# Altium project flap.PrjPCB
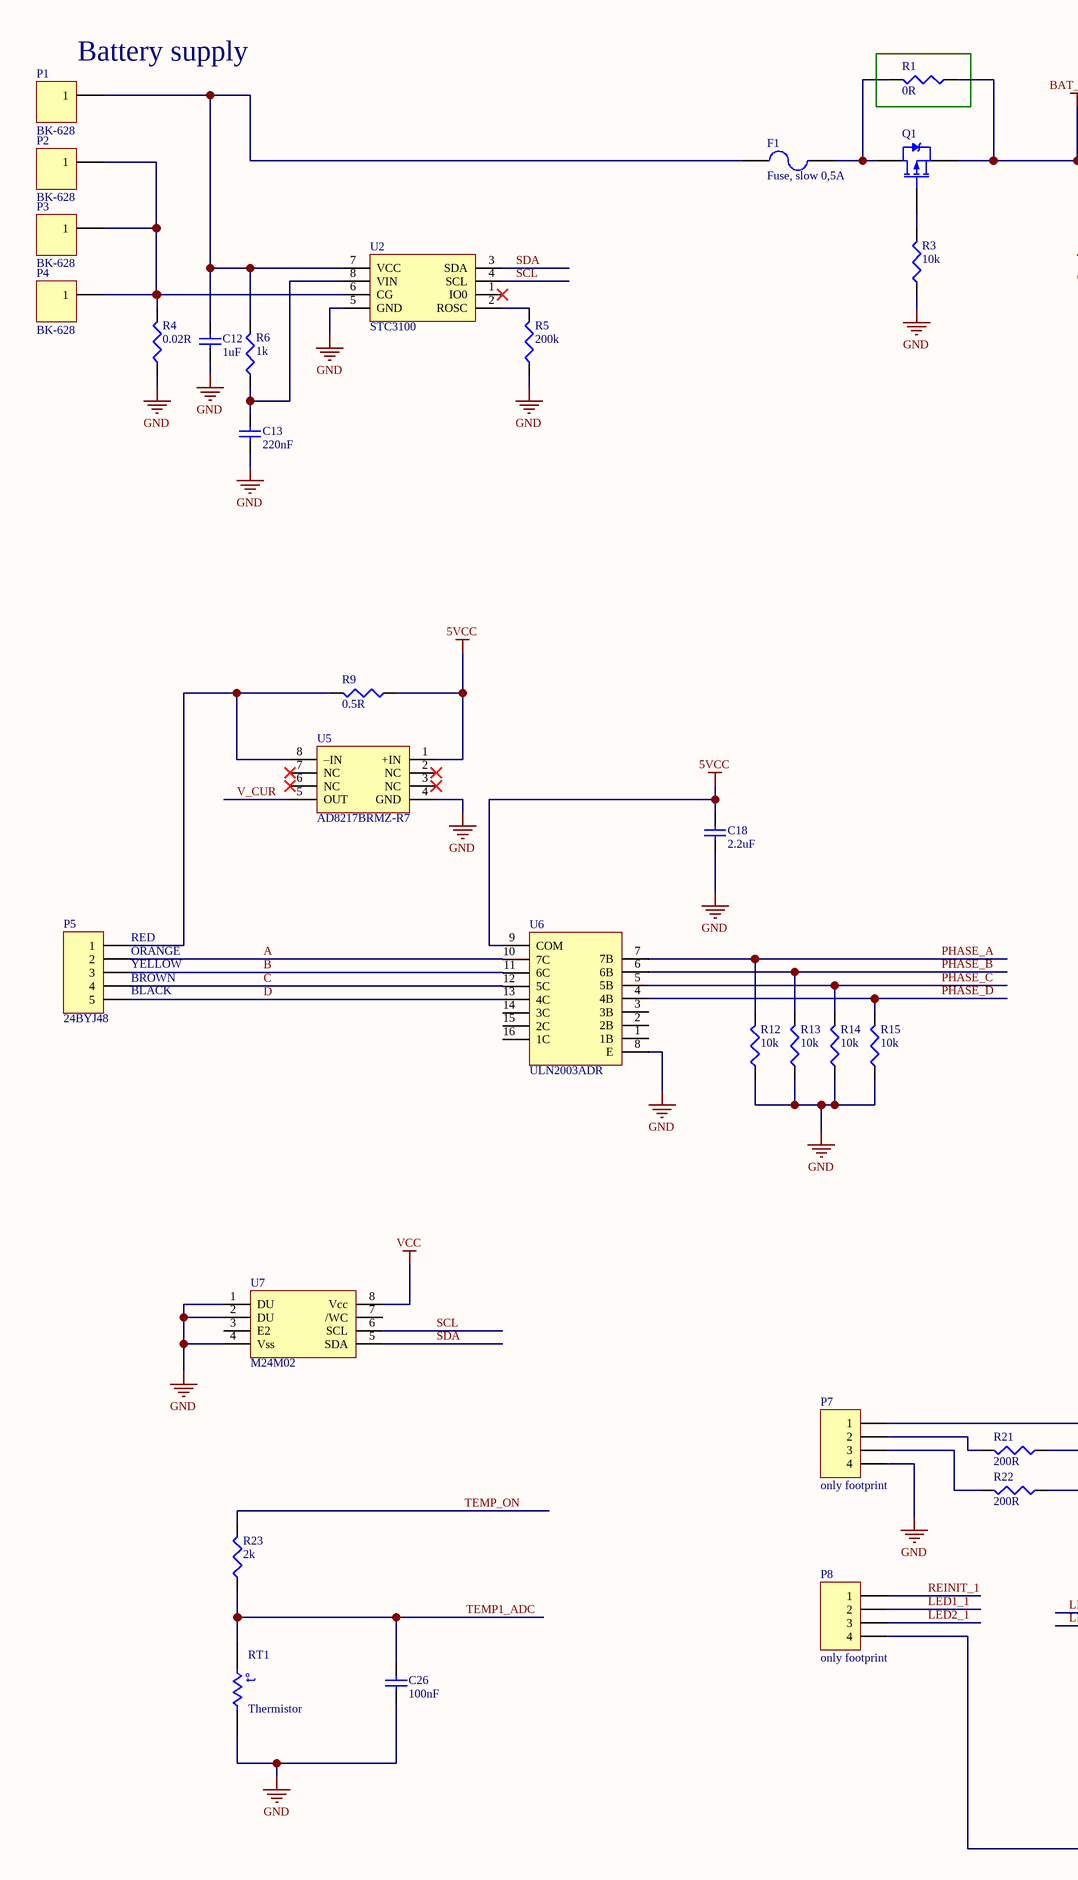
[diagram p0: flap.SchDoc, left]
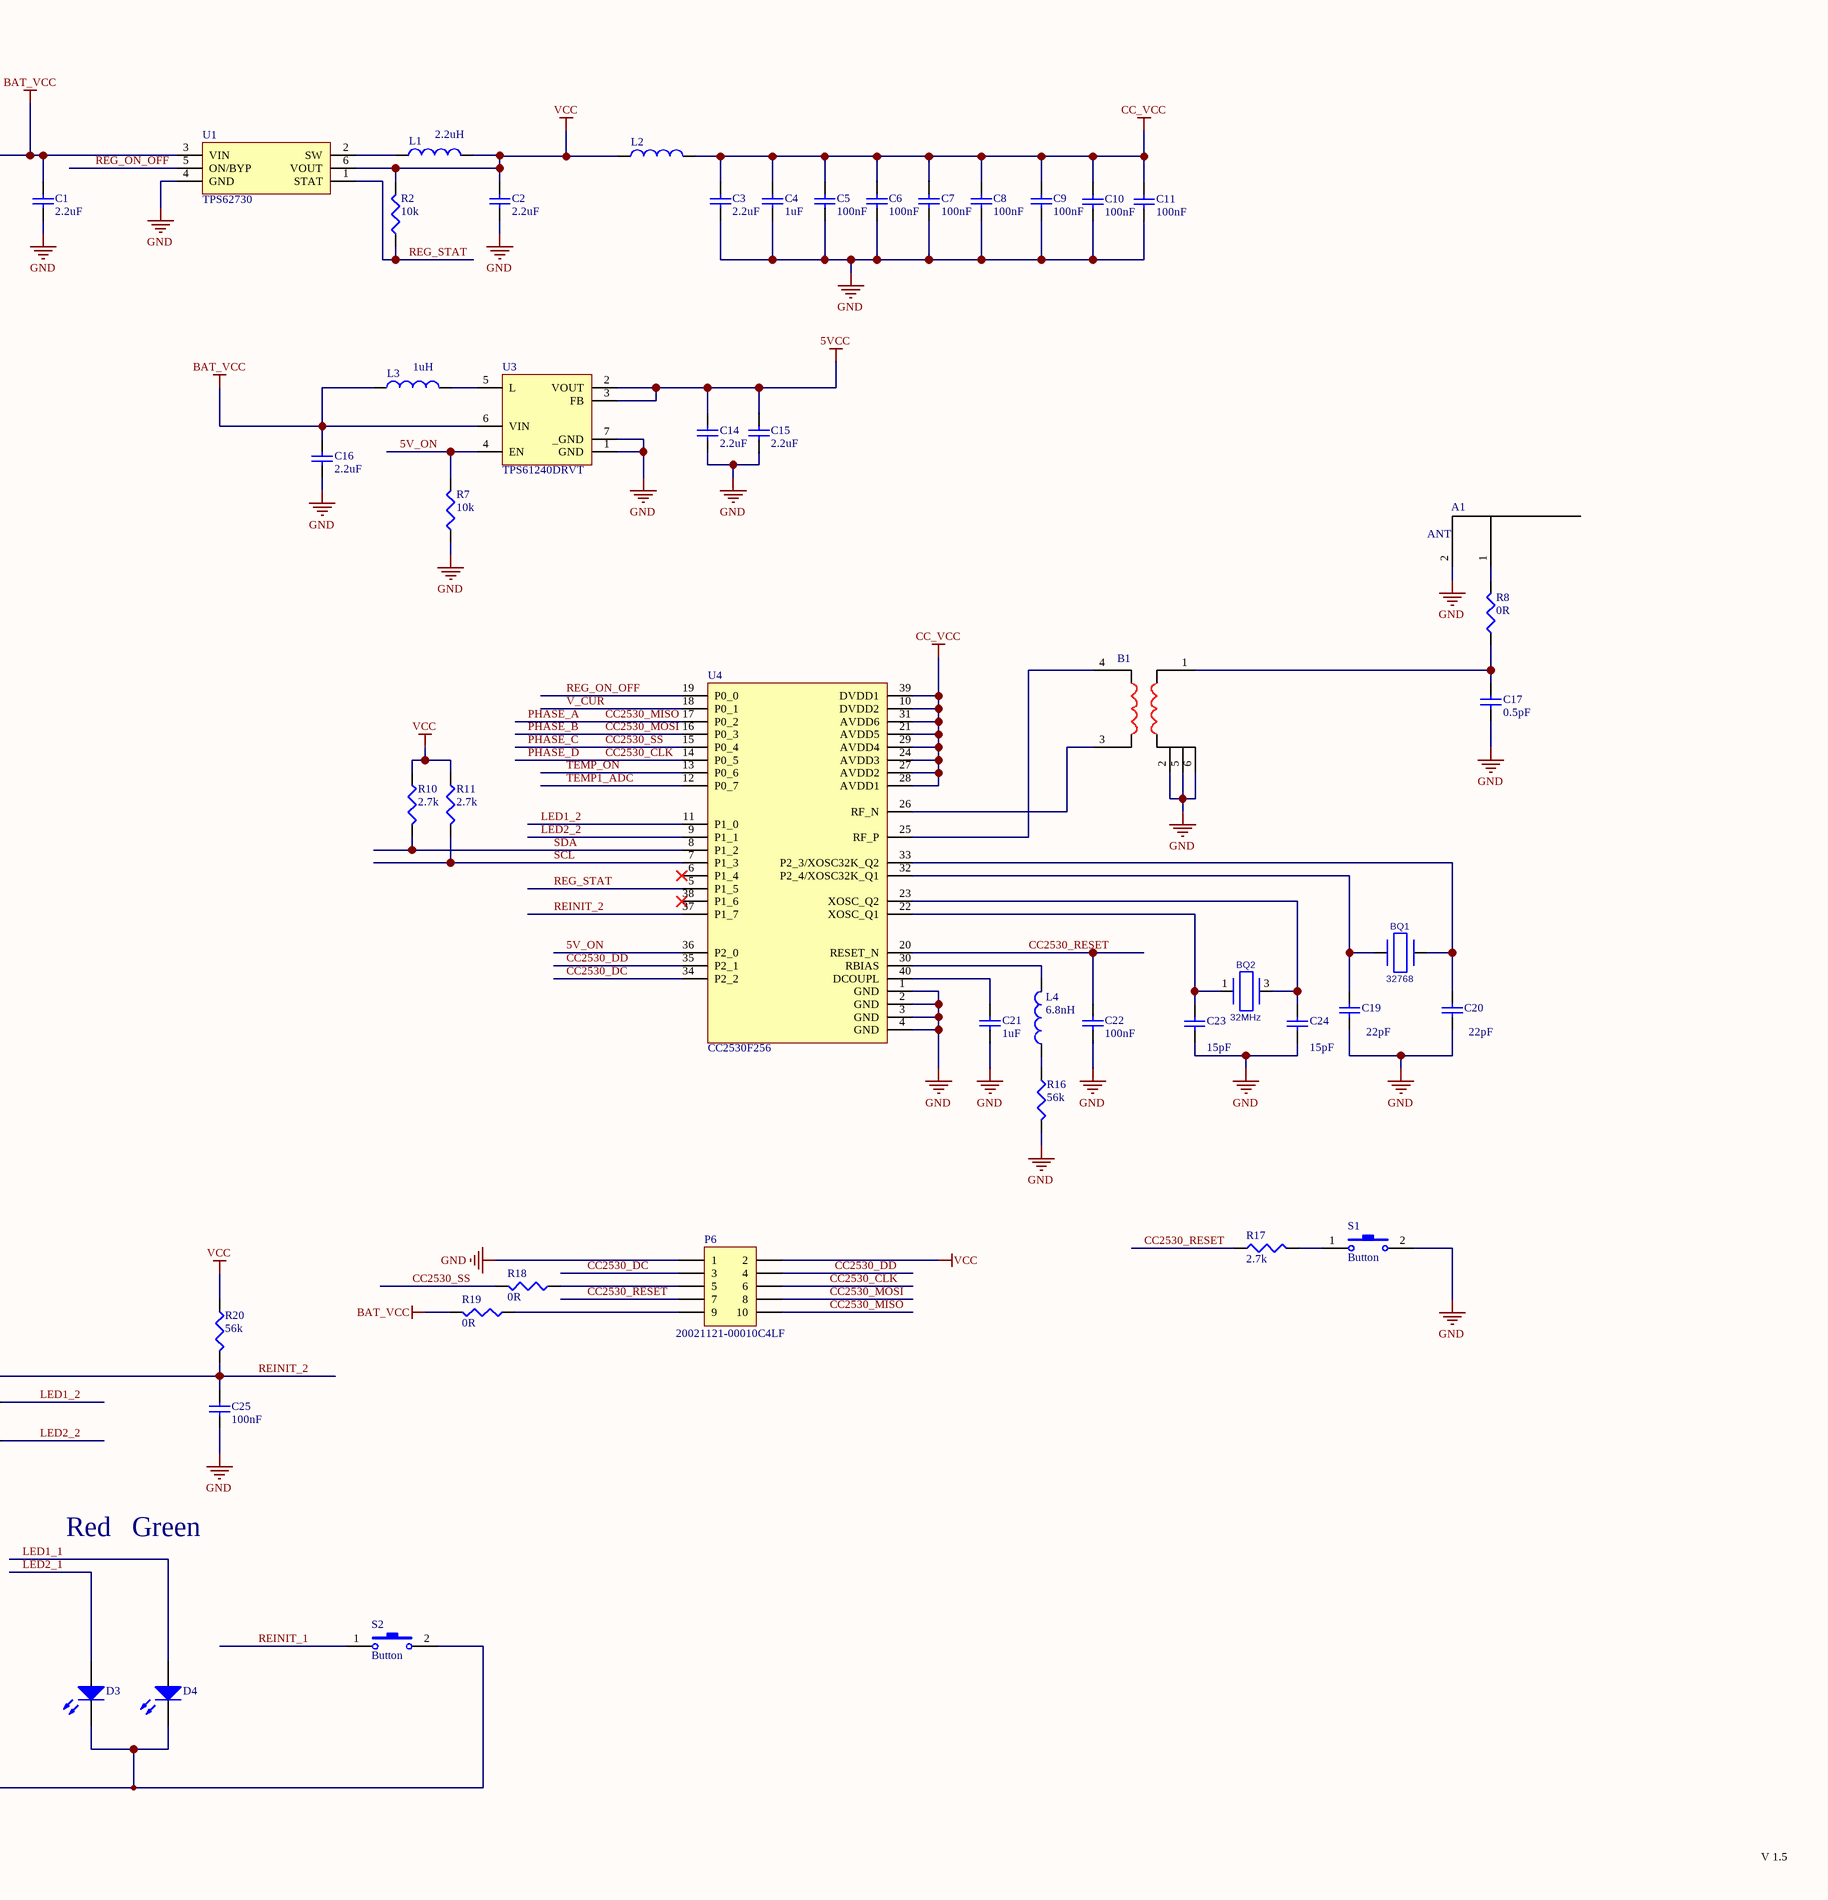
[diagram p1: flap.SchDoc, right]
1 sheet, 79 parts. Net scope: global (net labels, ports and power ports of the same name join across sheets).
Board file: flap.PcbDoc

## Sheet flap.SchDoc
size A2

### Parts
A1  ANT  [F ant]
B1  BALUN  [2450BM15A0002]  (value not drawn)
BQ1  value 32768  [FC-12M]  (hidden comment: Crystal)
BQ2  value 32MHz  [403C11A32M00000]  (hidden comment: Crystal)
C1  value 2.2uF  [0402]  (hidden comment: Capacitor)
C2  value 2.2uF  [0402]  (hidden comment: Capacitor)
C3  value 2.2uF  [0402]  (hidden comment: Capacitor)
C4  value 1uF  [0402]  (hidden comment: Capacitor)
C5  value 100nF  [0402]  (hidden comment: Capacitor)
C6  value 100nF  [0402]  (hidden comment: Capacitor)
C7  value 100nF  [0402]  (hidden comment: Capacitor)
C8  value 100nF  [0402]  (hidden comment: Capacitor)
C9  value 100nF  [0402]  (hidden comment: Capacitor)
C10  value 100nF  [0402]  (hidden comment: Capacitor)
C11  value 100nF  [0402]  (hidden comment: Capacitor)
C12  value 1uF  [0402]  (hidden comment: Capacitor)
C13  value 220nF  [0402]  (hidden comment: Capacitor)
C14  value 2.2uF  [0402]  (hidden comment: Capacitor)
C15  value 2.2uF  [0402]  (hidden comment: Capacitor)
C16  value 2.2uF  [0402]  (hidden comment: Capacitor)
C17  value 0.5pF  [0402]  (hidden comment: Capacitor)
C18  value 2.2uF  [0402]  (hidden comment: Capacitor)
C19  value 22pF  [0402]  (hidden comment: Capacitor)
C20  value 22pF  [0402]  (hidden comment: Capacitor)
C21  value 1uF  [0402]  (hidden comment: Capacitor)
C22  value 100nF  [0402]  (hidden comment: Capacitor)
C23  value 15pF  [0402]  (hidden comment: Capacitor)
C24  value 15pF  [0402]  (hidden comment: Capacitor)
C25  value 100nF  [0402]  (hidden comment: Capacitor)
C26  value 100nF  [0402]  (hidden comment: Capacitor)
D3  Led  [LED0603]  (value not drawn)
D4  Led  [LED0603]  (value not drawn)
F1  Fuse, slow 0,5A  [SF1206S0502]
L1  value 2.2uH  [6-0805_L]  (hidden comment: Inductor)
L2  Inductor  [0402]  (value not drawn)
L3  value 1uH  [1008]  (hidden comment: Inductor)
L4  value 6.8nH  [0402]  (hidden comment: Inductor)
P1  Manufacturer Part Number: BK-628  [BAT_CLIP1]  (hidden comment: Connector)
P2  Manufacturer Part Number: BK-628  [BAT_CLIP1]  (hidden comment: Connector)
P3  Manufacturer Part Number: BK-628  [BAT_CLIP1]  (hidden comment: Connector)
P4  Manufacturer Part Number: BK-628  [BAT_CLIP1]  (hidden comment: Connector)
P5  24BYJ48  [HDR1X5H]
P6  *  [20021121-00010C4LF]  (value not drawn)
P7  Manufacturer Part Number: only footprint  [HDR1X4]  (hidden comment: Header 4)
P8  Manufacturer Part Number: only footprint  [HDR1X4]  (hidden comment: Header 4)
Q1  IRLML6302GTRPBF  [SOT-23_N]  (value not drawn)
R1  value 0R  [0402]  (hidden comment: Blob)
R2  value 10k  [0402]  (hidden comment: Resistor)
R3  value 10k  [0402]  (hidden comment: Resistor)
R4  value 0.02R  [0603]  (hidden comment: Resistor)
R5  value 200k  [6-0805_L]  (hidden comment: Resistor)
R6  value 1k  [0402]  (hidden comment: Resistor)
R7  value 10k  [0402]  (hidden comment: Resistor)
R8  value 0R  [0402]  (hidden comment: Blob)
R9  value 0.5R  [0402]  (hidden comment: Resistor)
R10  value 2.7k  [0402]  (hidden comment: Resistor)
R11  value 2.7k  [0402]  (hidden comment: Resistor)
R12  value 10k  [0402]  (hidden comment: Resistor)
R13  value 10k  [0402]  (hidden comment: Resistor)
R14  value 10k  [0402]  (hidden comment: Resistor)
R15  value 10k  [0402]  (hidden comment: Resistor)
R16  value 56k  [0402]  (hidden comment: Resistor)
R17  value 2.7k  [0402]  (hidden comment: Resistor)
R18  value 0R  [0402]  (hidden comment: Blob)
R19  value 0R  [0402]  (hidden comment: Blob)
R20  value 56k  [0402]  (hidden comment: Resistor)
R21  value 200R  [0603]  (hidden comment: Resister)
R22  value 200R  [0603]  (hidden comment: Resister)
R23  value 2k  [0603]  (hidden comment: Resistor)
RT1  Thermistor  [0603]
S1  Button  [EVQP2402W]
S2  Button  [EVQP2402W]
U1  TPS62730  [6SON]
U2  STC3100  [DFN8]
U3  TPS61240DRVT  [WSON6]
U4  CC2530F256  [QFN40]
U5  AD8217BRMZ-R7  [8MSOP]
U6  ULN2003ADR  [16SOIC]
U7  M24M02  [SO8]

### Nets
5VCC: C14.1 C15.1 C18.1 R9.2 U3.2(VOUT) U3.3(FB) U5.1(+IN) U6.9(COM)
BAT_VCC: C1.1 C16.1 L3.1 Q1.2(S) R1.1 R19.2 U1.3(VIN) U3.6(VIN)
CC_VCC: C3.1 C4.1 C5.1 C6.1 C7.1 C8.1 C9.1 C10.1 C11.1 L2.2 U4.10(DVDD2) U4.21(AVDD5) U4.24(AVDD3) U4.27(AVDD2) U4.28(AVDD1) U4.29(AVDD4) U4.31(AVDD6) U4.39(DVDD1)
GND: A1.2 B1.2 B1.5 B1.6 C1.2 C2.2 C3.2 C4.2 C5.2 C6.2 C7.2 C8.2 C9.2 C10.2 C11.2 C12.2 C13.2 C14.2 C15.2 C16.2 C17.2 C18.2 C19.1 C20.1 C21.2 C22.2 C23.1 C24.1 C25.2 C26.2 P6.1 P7.4 R3.2 R4.2 R5.2 R7.2 R12.2 R13.2 R14.2 R15.2 R16.2 RT1.2 S1.2 U1.4(GND) U2.5(GND) U3.1(GND) U3.7(_GND) U4.1(GND) U4.2(GND) U4.3(GND) U4.4(GND) U5.4(GND) U6.8(E) U7.1(DU) U7.2(DU) U7.4(Vss)
VCC: C2.1 L1.2 L2.1 P6.2 R2.1 R10.2 R11.2 R20.1 U1.6(VOUT) U7.8(Vcc)
5V_ON: R7.1 U3.4(EN) U4.36(P2_0)
A: P5.2 U6.10(7C)
B: P5.3 U6.11(6C)
C: P5.4 U6.12(5C)
CC2530_CLK: P6.6 R15.1 U4.14(P0_5) U6.4(4B)  [also labelled PHASE_D]
CC2530_DC: P6.3 U4.34(P2_2)
CC2530_DD: P6.4 U4.35(P2_1)
CC2530_MISO: P6.10 R12.1 U4.17(P0_2) U6.7(7B)  [also labelled PHASE_A]
CC2530_MOSI: P6.8 R13.1 U4.16(P0_3) U6.6(6B)  [also labelled PHASE_B]
CC2530_RESET: C22.1 P6.7 R17.2 U4.20(RESET_N)
CC2530_SS: R14.1 R18.2 U4.15(P0_4) U6.5(5B)  [also labelled PHASE_C]
D: P5.5 U6.13(4C)
LED1_1: D4.1(A) P8.2
LED1_2: R21.2 U4.11(P1_0)
LED2_1: D3.1(A) P8.3
LED2_2: R22.2 U4.9(P1_1)
REG_ON_OFF: U1.5(ON/BYP) U4.19(P0_0)
REG_STAT: R2.2 U1.1(STAT) U4.5(P1_5)
REINIT_1: P8.1 S2.1
REINIT_2: C25.1 P7.1 R20.2 U4.37(P1_7)
SCL: R11.1 U2.4(SCL) U4.7(P1_3) U7.6(SCL)
SDA: R10.1 U2.3(SDA) U4.8(P1_2) U7.5(SDA)
TEMP1_ADC: C26.1 R23.1 RT1.1 U4.12(P0_7)
TEMP_ON: R23.2 U4.13(P0_6)
V_CUR: U4.18(P0_1) U5.5(OUT)
NetA1_1: A1.1 R8.2
NetB1_1: B1.1 C17.1 R8.1
NetB1_3: B1.3 U4.26(RF_N)
NetB1_4: B1.4 U4.25(RF_P)
NetBQ1_1: BQ1.1 C19.2 U4.32(P2_4/XOSC32K_Q1)
NetBQ1_2: BQ1.2 C20.2 U4.33(P2_3/XOSC32K_Q2)
NetBQ2_1: BQ2.1 C23.2 U4.22(XOSC_Q1)
NetBQ2_3: BQ2.3 C24.2 U4.23(XOSC_Q2)
NetC12_1: C12.1 F1.1 P1.1 R6.1 U2.7(VCC)
NetC13_1: C13.1 R6.2 U2.8(VIN)
NetC21_1: C21.1 U4.40(DCOUPL)
NetD3_2: D3.2(K) D4.2(K) P8.4 S2.2
NetF1_2: F1.2 Q1.3(D) R1.2
NetL1_1: L1.1 U1.2(SW)
NetL3_2: L3.2 U3.5(L)
NetL4_1: L4.1 R16.1
NetL4_2: L4.2 U4.30(RBIAS)
NetP2_1: P2.1 P3.1 P4.1 R4.1 U2.6(CG)
NetP5_1: P5.1 R9.1 U5.8(–IN)
NetP6_5: P6.5 R18.1
NetP6_9: P6.9 R19.1
NetP7_2: P7.2 R21.1
NetP7_3: P7.3 R22.1
NetQ1_1: Q1.1(G) R3.1
NetR5_1: R5.1 U2.2(ROSC)
NetR17_1: R17.1 S1.1

Not connected (* = marked no-connect by the designer): U2 1(IO0)*; U4 6(P1_4)* 38(P1_6)*; U5 2(NC)* 3(NC)* 6(NC)* 7(NC)*; U6 1(1B) 2(2B) 3(3B) 14(3C) 15(2C) 16(1C); U7 3(E2) 7(/WC)

### Notes on the sheet
- (near P1) Battery supply
- (near P5) RED
- (near P5) ORANGE
- (near P5) YELLOW
- (near P5) BLACK
- (near P5) BROWN
- Red   Green
- V 1.5
- (in symbol Res Thermal) t°

### Library data of the parts
A1 = ANT: Inverted-F Antenna; Manufacturer Part Number: PCB ANT; Mount: 1; Manufacturer: *
B1 = BALUN: BALUN JTI MATCHED ZIGBEE; Manufacturer Part Number: 2450BM15A0002E; Manufacturer: Johanson Technology Inc; Mount: 1
BQ1 = 6LC:308C: CRYSTAL 32.768KHZ 12.5PF SMD; Manufacturer Part Number: FC-12M 32.7680KA-A3; Manufacturer: EPSON; Mount: 1
BQ2 = HC-49SMD: CRYSTAL 32MHZ 10PF SMD; Manufacturer: CTS-Frequency Controls; Manufacturer Part Number: 403C11A32M00000; Mount: 1
C1-C3 C14-C16 C18 = Cap: CAP CER 2.2UF 6.3V 20% X5R 0402; Manufacturer Part Number: CL05A225MQ5NNNC; Manufacturer: Samsung Electro-Mechanics America, Inc; Mount: 1
C4 C12 C21 = Cap: CAP CER 1UF 6.3V 10% X5R 0402; Manufacturer Part Number: GRM155R60J105KE19D; Manufacturer: Murata Electronics North America; Mount: 1
C5-C11 C22 C25 C26 = Cap: CAP CER 0.1UF 10V 20% X5R 0402; Manufacturer Part Number: CL05A104MP5NNNC; Manufacturer: Samsung Electro-Mechanics America, Inc; Mount: 1
C13 = Cap: CAP CER 0.22UF 10V 10% X5R 0402; Manufacturer Part Number: CL05A224KP5NNNC; Manufacturer: Samsung Electro-Mechanics America, Inc; Mount: 1
C17 = Cap: CAP CER 0.5PF 50V NP0 0402; Manufacturer Part Number: GRM1555C1HR50CA01D; Manufacturer: Murata Electronics North America; Mount: 1
C19 C20 = Cap: CAP CER 22PF 50V 5% NP0 0402; Manufacturer Part Number: GRM1555C1H220JA01D; Manufacturer: Murata Electronics North America; Mount: 1
C23 C24 = Cap: CAP CER 15PF 50V 5% NP0 0402; Manufacturer Part Number: GRM1555C1H150JA01D; Manufacturer: Murata Electronics North America; Mount: 1
D3 = LED0: LED SUPER RED CLEAR 0603 SMD; Manufacturer Part Number: LTST-C190KRKT; Manufacturer: Lite-On Inc; Mount: 1
D4 = LED0: LED GREEN CLEAR THIN 0603 SMD; Manufacturer Part Number: LTST-C191KGKT; Manufacturer: Lite-On Inc; Mount: 1
F1 = Fuse 2: FUSE 0,5A 63V 1206 SLOW; Manufacturer Part Number: SF-1206S050-2; Manufacturer: Bourns Inc.; Mount: 1
L1 = Inductor: INDUCTOR 2.2UH 0805; Manufacturer Part Number: LQM21PN2R2NGCD; Manufacturer: Murata Electronics North America; Mount: 1
L2 = Inductor: FILTER CHIP 1000 OHM 250MA 0402; Manufacturer Part Number: BLM15HG102SN1D; Manufacturer: Murata Electronics North America; Mount: 1
L3 = Inductor: INDUCTOR POWER 1UH 2.2A 1008; Manufacturer Part Number: CIG22E1R0MNE; Manufacturer: Samsung Electro-Mechanics America, Inc; Mount: 1
L4 = Inductor: INDUCTOR 6.8NH 300MA 0402; Manufacturer Part Number: LQG15HS6N8J02D; Manufacturer: Murata Electronics North America; Mount: 1
P1-P4 = Header 2: CONTACT BATTERY AA NEGATIVE; Manufacturer: MPD (Memory Protection Devices); Mount: 1
P5 = Header 5H: Header, 5-Pin, Right Angle; Manufacturer Part Number: 68016-205HLF; Manufacturer: FCI; Mount: 0
P6 = Header 5X2: CONN HEADER 10POS DL UNSHRD SMD; Manufacturer: FCI; Manufacturer Part Number: 20021121-00010C4LF; Mount: 1
P7 P8 = Header 4: Header, 4-Pin; Mount: 1; Manufacturer: *
Q1 = IRLML6302: HEXFET Power MOSFET; Manufacturer: International Rectifier; Published: 8-Jun-2000; LatestRevisionDate: 20-Nov-2009; LatestRevisionNote: IPC-7351 Footprint Added.; DatasheetVersion: Aug-1997; PackageReference: SOT-23; Publisher: Altium Limited; PackageDescription: 3-Pin SOT-23 Package 0.95 mm Pitch, 2.3 mm Lead Span; ComponentLink1Description: Manufacturer Link; ComponentLink1URL: http://www.irf.com/; ComponentLink2Description: Datasheet; ComponentLink2URL: http://www.irf.com/product-info/datasheets/data/irlml6302.pdf; Manufacturer Part Number: IRLML6302GTRPBF; Mount: 1
R1 R8 R18 R19 = Res3: RES 0.0 OHM 1/10W JUMP 0402 SMD; Manufacturer Part Number: ERJ-2GE0R00X; Manufacturer: Panasonic Electronic Components
  R1 R19: Mount: 0
  R8 R18: Mount: 1
R2 R3 R7 R12-R15 = Res3: RES 10K OHM 1/10W 5% 0402 SMD; Manufacturer Part Number: ERJ-2GEJ103X; Manufacturer: Panasonic Electronic Components; Mount: 1
R4 = Res3: RES 0.02 OHM 1/4W 1% 0603; Manufacturer Part Number: RU1608FR020CS; Manufacturer: Samsung Electro-Mechanics America, Inc; Mount: 1
R5 = Res3: RES 200K OHM 1/8W .1% 0805 SMD; Manufacturer Part Number: ERA-6AEB204V; Manufacturer: Panasonic Electronic Components; Mount: 1
R6 = Res3: RES 1K OHM 1/10W 1% 0402 SMD; Manufacturer Part Number: ERJ-2RKF1001X; Manufacturer: Panasonic Electronic Components; Mount: 1
R9 = Res3: RES 0.5 OHM 1/16W 1% 0402 SMD; Manufacturer Part Number: RL0402FR-070R5L; Manufacturer: Yageo; Mount: 1
R10 R11 R17 = Res3: RES 2.7K OHM 1/10W 5% 0402 SMD; Manufacturer Part Number: ERJ-2GEJ272X; Manufacturer: Panasonic Electronic Components; Mount: 1
R16 R20 = Res3: RES 56K OHM 1/10W 1% 0402 SMD; Manufacturer Part Number: ERJ-2RKF5602X; Manufacturer: Panasonic Electronic Components; Mount: 1
R21 R22 = Res3: RES 200 OHM 1/10W 5% 0603 SMD; Manufacturer Part Number: RC0603JR-07200RL; Manufacturer: Yageo; Mount: 1
R23 = Res3: RES 2.0K OHM 1/10W 5% 0603 SMD; Manufacturer Part Number: RC0603JR-072KL; Manufacturer: Yageo; Mount: 1
RT1 = Res Thermal: THERMISTOR NTC 1K OHM 5% 0603; Manufacturer Part Number: ERT-J1VT102J; Manufacturer: Panasonic Electronic Components; Mount: 1
S1 S2 = SW-PB: SWITCH TACTILE SPST-NO 0.02A 15V; Manufacturer Part Number: EVQ-P2402W; Manufacturer: Panasonic Electronic Components; Mount: 1
U1 = TPS62730: IC DCDC CONV STP-DN SYNC LP 6SON; Manufacturer Part Number: TPS62730DRYT; Manufacturer: Texas Instruments; Mount: 1
U2 = STC3100: IC BATTERY MON W/GAUGE 8-DFN; Manufacturer Part Number: STC3100IQT; Manufacturer: STMicroelectronics; Mount: 1
U3 = TPS61240DRVT: IC REG BOOST SYNC 5V 0.45A 6SON; Manufacturer: Texas Instruments; Manufacturer Part Number: TPS61240DRVT; Mount: 1
U4 = CC2530F256: IC SOC IEEE 802.15.4/ZIG 40VQFN; Manufacturer Part Number: CC2530F256RHAT; Manufacturer: Texas Instruments; Mount: 1
U5 = AD8217BRMZ-R7: IC CURRENT MONITOR HI SIDE 8MSOP; Manufacturer: Analog Devices Inc; Manufacturer Part Number: AD8217BRMZ-R7; Mount: 1
U6 = ULN2004ADR: TRANS 7 NPN DARL 50V 500MA 16SO; Manufacturer: Texas Instruments; Manufacturer Part Number: ULN2003ADR; Mount: 1
U7 = M24M02: IC EEPROM 2MBIT 1MHZ 8SO; Manufacturer Part Number: M24M02-DRMN6TP; Manufacturer: STMicroelectronics; Mount: 1